# EAGLE design MicroLock_PassThrough (EAGLE 9.6.2)
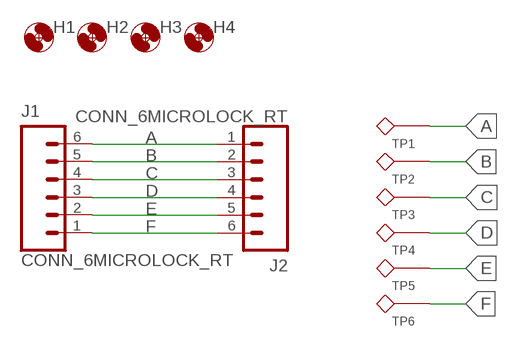
[diagram p0: schematic, sheet 1]

## Parts
H1  MOUNTING_HOLE2_NP  [2_56]
H2  MOUNTING_HOLE2_NP  [2_56]
H3  MOUNTING_HOLE2_NP  [2_56]
H4  MOUNTING_HOLE2_NP  [2_56]
J1  CONN_6MICROLOCK_RT  [1X06_MICROLOCKPLUS_RT]
J2  CONN_6MICROLOCK_RT  [1X06_MICROLOCKPLUS_RT]
TP1  TESTPOINTRCU  [TESTPOINT_0603]
TP2  TESTPOINTRCU  [TESTPOINT_0603]
TP3  TESTPOINTRCU  [TESTPOINT_0603]
TP4  TESTPOINTRCU  [TESTPOINT_0603]
TP5  TESTPOINTRCU  [TESTPOINT_0603]
TP6  TESTPOINTRCU  [TESTPOINT_0603]

## Nets
A: J1.6 J2.1 TP1.1
B: J1.5 J2.2 TP2.1
C: J1.4 J2.3 TP3.1
D: J1.3 J2.4 TP4.1
E: J1.2 J2.5 TP5.1
F: J1.1 J2.6 TP6.1

## Library data of the parts
H1-H4 = bschulz:MOUNTING_HOLE: Genaric Mechanical Mounting Hole Hole diameter based on max body diameter + 15% Keepout ring is for diameter of socket cap screw (minimum required clearance) TPlace ring is for diameter of pan head screw (recomended clearance) Specifications: Socket Cap <http://fastener-express.com/fastener-technical/SocketscapSS-Alloy.pdf> Button Head Socket Cap <http://fastener-express.com/fastener-technical/Button-Socket-alloy.pdf> Pan Head <http://fastener-express.com/fastener-technical/pan-machine-Screws.pdf>; DIGIKEY: DNP; MF: N/A; MPN: DNP
J1 J2 = bschulz:CONN_6: Genaric 6 terminal header Digikey 2.54_SCREW <https://www.digikey.com/product-detail/en/on-shore-technology-inc/OSTVN06A150/ED10565-ND/1588866>; DIGIKEY: WM22471CT-ND; MF: Molex; MPN: 5055670681
TP1-TP6 = bschulz:TESTPOINT; DIGIKEY: A106145CT-ND; MF: TE Connectivity; MPN: RCU-0C

## Board
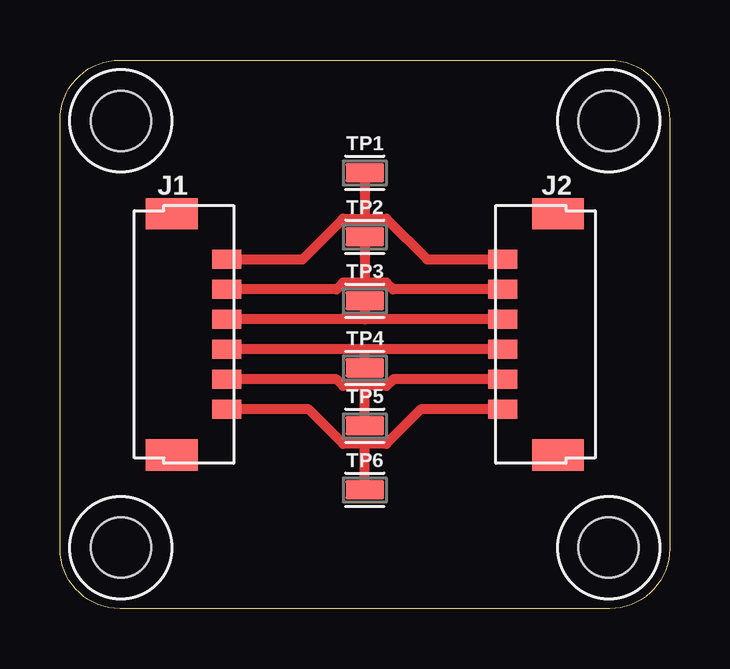
[diagram p1: board, top side]

Size 25.4 x 22.86 mm. Coordinates in mm from the lower left corner, seen from the top.
Outline: 2.5,22.86 22.9,22.86 arc-90 25.4,20.36 25.4,2.5 arc-90 22.9,0 2.5,0 arc-90 0,2.5 0,20.36 arc-90 2.5,22.86
Copper layers (1*16): Top 0.035mm / dielectric 1.5mm / Bottom 0.035mm
Design rules "default": minimum track width 6mil, minimum drill 0.35mm, track to track 6mil, track to pad 6mil, pad to pad 6mil, via to via 6mil, smd to smd 6mil, copper to edge 40mil, drill to drill 6mil, minimum pad ring 10mil, minimum via ring 8mil, stop-mask expansion 4mil, vias tented up to drill 0mil, thermal gap 10mil

### Footprints (pad centres in the part's own frame; a part is rotated, then mirrored left to right if it is on the bottom)
2_56 = hole 2.5: 0,0
1X06_MICROLOCKPLUS_RT = smd 0.8 x 1.2: 1 -3.125,-0.6; 2 -1.875,-0.6; 3 -0.625,-0.6; 4 0.625,-0.6; 5 1.875,-0.6; 6 3.125,-0.6 | smd 1.3 x 2.15: BODY@1 -5.025,1.695; BODY@2 5.025,1.695
TESTPOINT_0603 = smd 1.6 x 0.8: 1 0,0

### Placement (x,y rotation side)
H1  2.54,2.54 0 top
H2  2.54,20.32 0 top
H3  22.86,2.54 0 top
H4  22.86,20.32 0 top
J1  6.35,11.43 90 top
J2  19.05,11.43 270 top
TP1  12.7,18.16 0 top
TP2  12.7,15.49 0 top
TP3  12.7,12.83 0 top
TP4  12.7,10.03 0 top
TP5  12.7,7.62 0 top
TP6  12.7,4.95 0 top

### Tracks (layer width: path | path; a pad name or v marks a point on that pad's centre or on a via)
A
  Top 0.406: J1.6 10.11,14.55 11.8,16.25 12.7,16.25 | J2.1 15.29,14.55 13.6,16.25 12.7,16.25 | TP1.1 12.7,16.25
B
  Top 0.406: J2.2 13.88,13.3 13.6,13.58 12.7,13.58 | J1.5 11.52,13.3 11.8,13.58 12.7,13.58 | TP2.1 12.7,13.58
C
  Top 0.406: J2.3 12.7,12.05 | 12.7,12.05 J1.4 | TP3.1 12.7,12.05
D
  Top 0.406: J2.4 12.7,10.8 | 12.7,10.8 J1.3 | TP4.1 12.7,10.8
E
  Top 0.406: J2.5 13.88,9.55 13.6,9.28 12.7,9.28 | J1.2 11.52,9.55 11.8,9.28 12.7,9.28 | TP5.1 12.7,9.28
F
  Top 0.406: J2.6 15.04,8.3 13.6,6.86 12.7,6.86 | J1.1 10.36,8.3 11.8,6.86 12.7,6.86 | TP6.1 12.7,6.86

### Text on the board
tDocu: MicroLock / Pass-Through | B. Schulz / Break44
bDocu: MicroLock Pass Through / v0.0 / B. Schulz / Break44